# EAGLE design AS1324_imp (EAGLE 6.4)
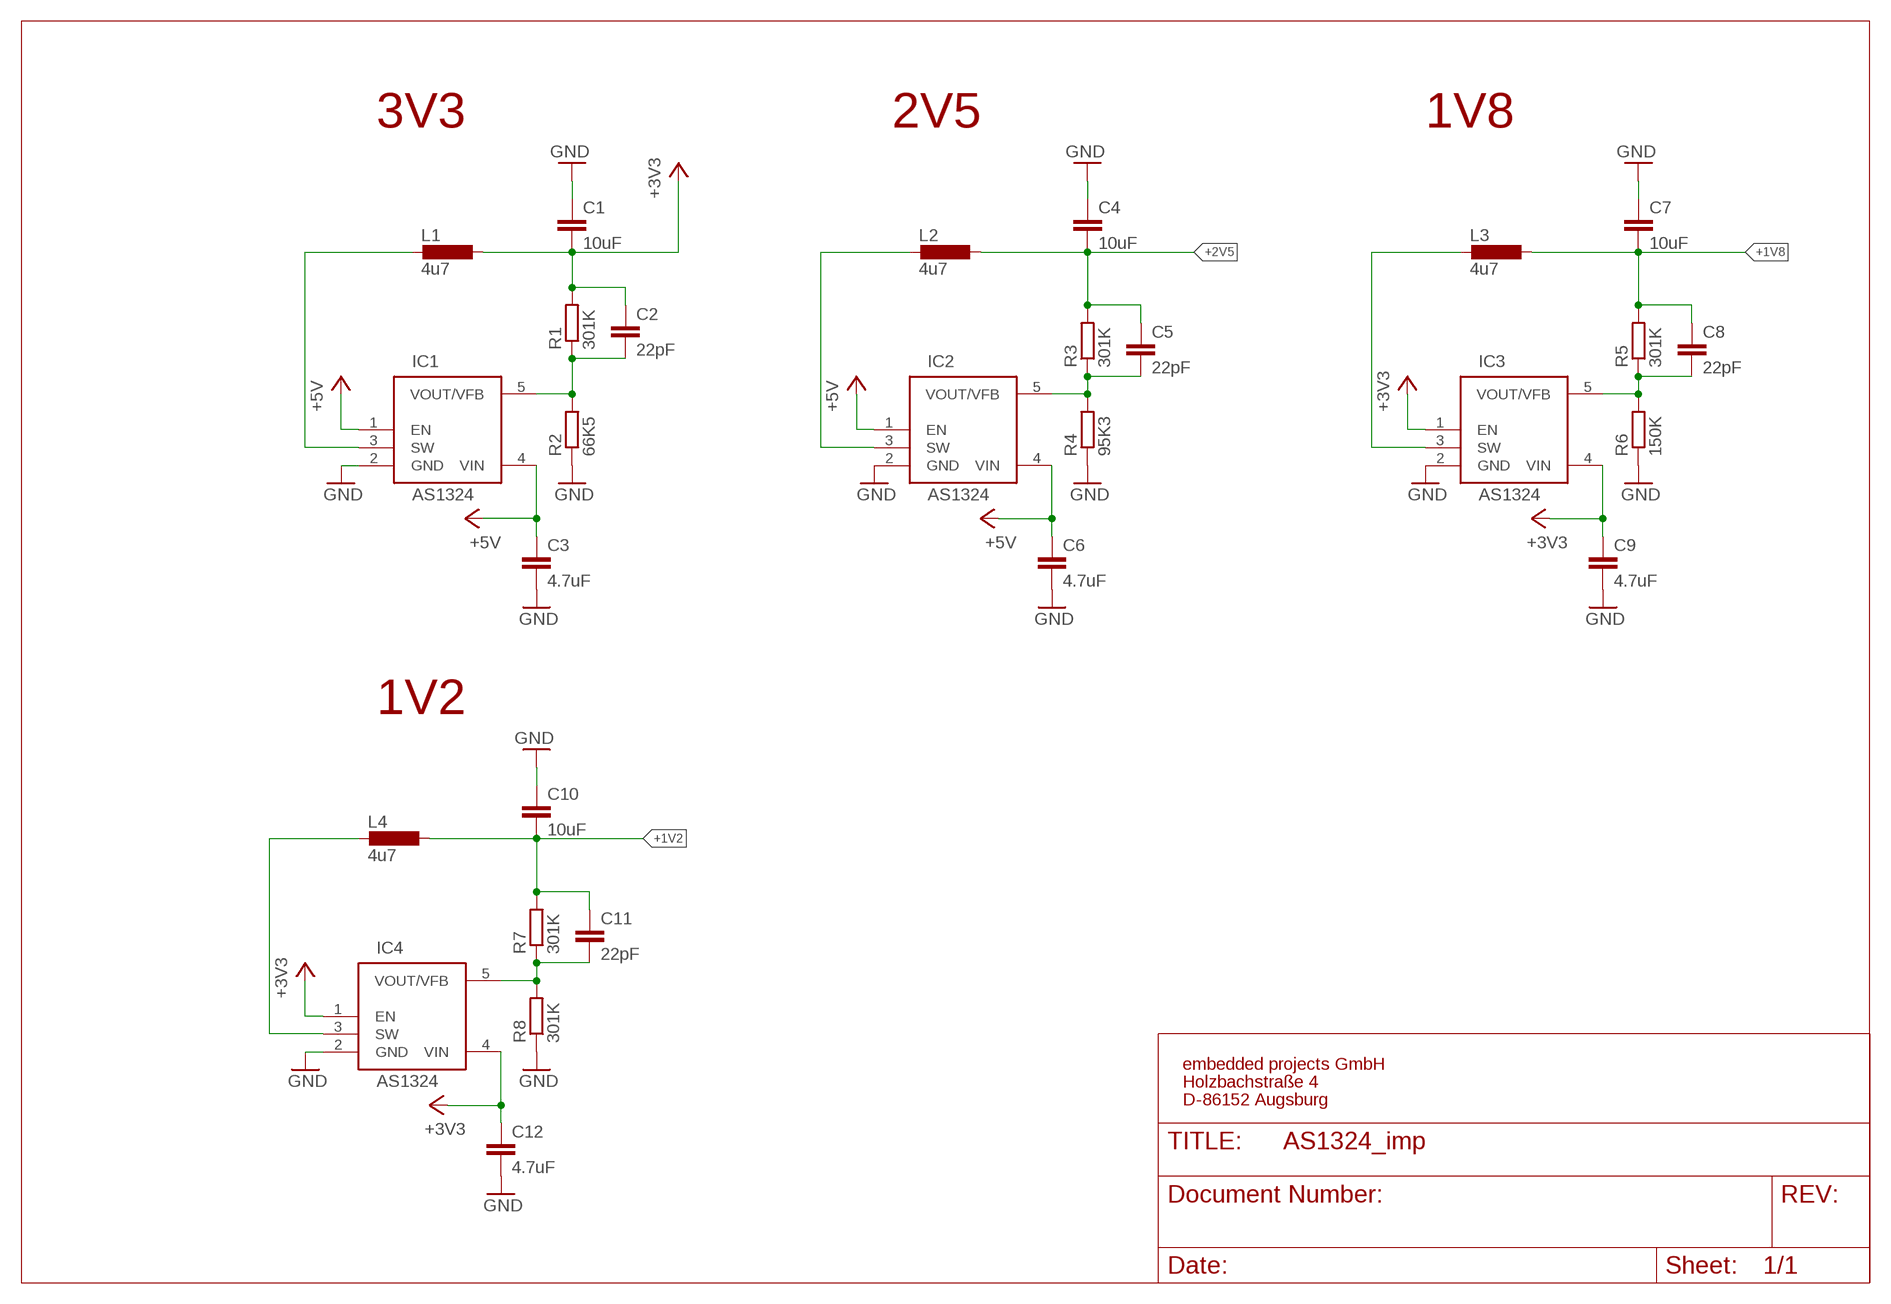
[diagram p0: schematic, sheet 1]

## Parts
C1  10uF  C-EUC0805  [C0805]
C2  22pF  C-EUC0805  [C0805]
C3  4.7uF  C-EUC0805  [C0805]
C4  10uF  C-EUC0805  [C0805]
C5  22pF  C-EUC0805  [C0805]
C6  4.7uF  C-EUC0805  [C0805]
C7  10uF  C-EUC0805  [C0805]
C8  22pF  C-EUC0805  [C0805]
C9  4.7uF  C-EUC0805  [C0805]
C10  10uF  C-EUC0805  [C0805]
C11  22pF  C-EUC0805  [C0805]
C12  4.7uF  C-EUC0805  [C0805]
IC1  AS1324  [TSOT23]
IC2  AS1324  [TSOT23]
IC3  AS1324  [TSOT23]
IC4  AS1324  [TSOT23]
L1  4u7  PSU3014  [PSU3014]
L2  4u7  PSU3014  [PSU3014]
L3  4u7  PSU3014  [PSU3014]
L4  4u7  PSU3014  [PSU3014]
R1  301K  R-EU_R0805  [R0805]
R2  66K5  R-EU_R0805  [R0805]
R3  301K  R-EU_R0805  [R0805]
R4  95K3  R-EU_R0805  [R0805]
R5  301K  R-EU_R0805  [R0805]
R6  150K  R-EU_R0805  [R0805]
R7  301K  R-EU_R0805  [R0805]
R8  301K  R-EU_R0805  [R0805]

## Nets
+1V2: C10.2 C11.1 L4.2 R7.2
+1V8: C7.2 C8.1 L3.2 R5.2
+2V5: C4.2 C5.1 L2.2 R3.2
+3V3: C1.2 C2.1 C9.1 C12.1 IC3.1(EN) IC3.4(VIN) IC4.1(EN) IC4.4(VIN) L1.2 R1.2
+5V: C3.1 C6.1 IC1.1(EN) IC1.4(VIN) IC2.1(EN) IC2.4(VIN)
GND: C1.1 C3.2 C4.1 C6.2 C7.1 C9.2 C10.1 C12.2 IC1.2(GND) IC2.2(GND) IC3.2(GND) IC4.2(GND) R2.1 R4.1 R6.1 R8.1
N$8: IC4.3(SW) L4.1
N$28: IC3.3(SW) L3.1
N$38: C11.2 IC4.5(VOUT/VFB) R7.1 R8.2
N$43: C8.2 IC3.5(VOUT/VFB) R5.1 R6.2
N$67: IC1.3(SW) L1.1
N$132: C2.2 IC1.5(VOUT/VFB) R1.1 R2.2
N$134: IC2.3(SW) L2.1
N$151: C5.2 IC2.5(VOUT/VFB) R3.1 R4.2

## Notes on the sheet
- 3V3 | 2V5 | 1V8
- 1V2
- embedded projects GmbH
- Holzbachstraße 4
- D-86152 Augsburg

## Library data of the parts
C1-C12 = rcl:C-EU: CAPACITOR, European symbol
IC1-IC4 = EmbeddedProjectsBauteile:AS1324: DC/DC Step-Down Regulator; EP: 400124
L1-L4 = KUBUS3B_PARTS2:PSU3014: SMD Power Inductors Shielded
R1-R8 = rcl:R-EU_: RESISTOR, European symbol

## Net classes
0 default: width 0.2 mm, drill 0.3 mm, clearance 0.2 mm
1 500mA: width 0.3 mm, drill 0.3 mm, clearance 0.15 mm
2 5V: width 0.305 mm, drill 0.4 mm, clearance 0.15 mm

## Board
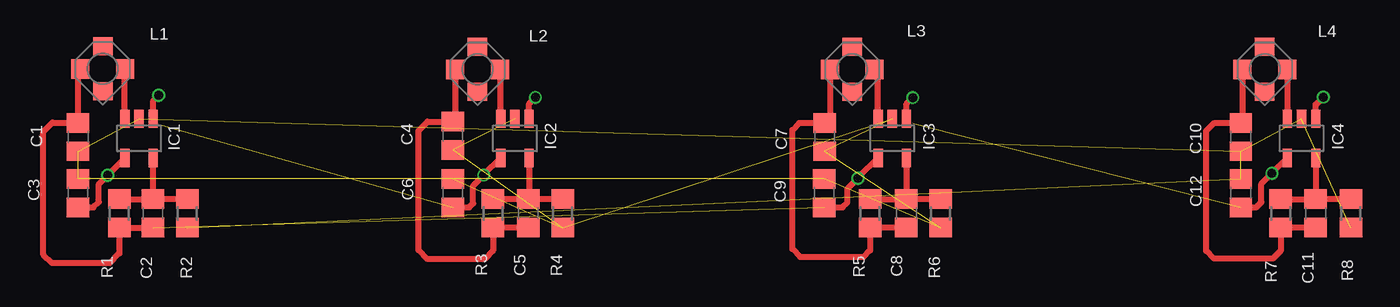
[diagram p1: board, top side]
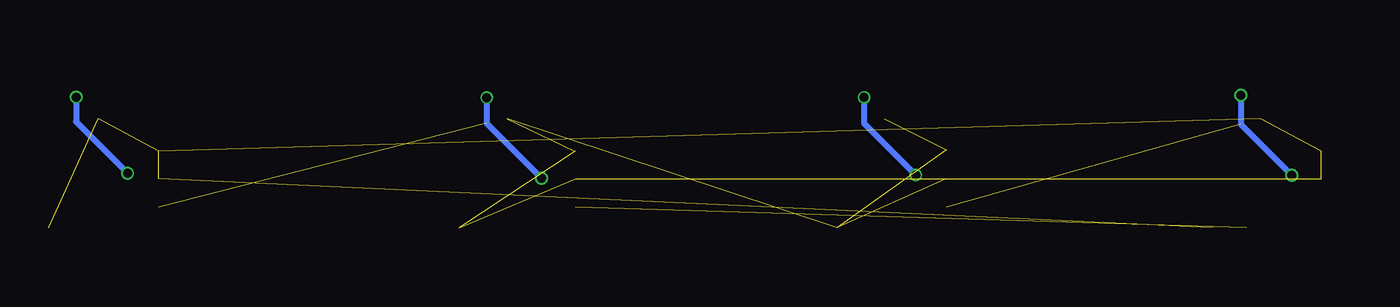
[diagram p2: board, bottom side, seen from below]

No outline drawn. Coordinates in mm, seen from the top.
Copper layers (1*2*15*16): Top 0.012mm / dielectric 0.36mm / Route2 0.018mm / dielectric 0.71mm / Route15 0.035mm / dielectric 0.2mm / Bottom 0.012mm
Design rules "125um_0.2mmborhung_4Layer *": minimum track width 0.125mm, minimum drill 0.25mm, track to track 0.125mm, track to pad 0.125mm, pad to pad 0.125mm, via to via 0.125mm, smd to smd 0mil, copper to edge 0.45mm, drill to drill 0.3mm, minimum pad ring 0.125mm, minimum via ring 0.125mm, stop-mask expansion 0.125mm, vias tented up to drill 40mil, thermal gap 0.2mm
bRestrict: area 51.6,54.2 to 59.1,60

### Footprints (pad centres in the part's own frame; a part is rotated, then mirrored left to right if it is on the bottom)
C0805 = smd 1.3 x 1.5: 1 -0.95,0; 2 0.95,0
TSOT23 = smd 0.622 x 1.22: 1 -0.95,-1.31; 2 0,-1.31; 3 0.95,-1.31; 4 0.95,1.31; 5 -0.95,1.31
PSU3014 = smd 1.2 x 1.3: 1 -1.5,0; 2 1.5,0 | smd 1.3 x 1.2: 3 0,1.5; 4 0,-1.5
R0805 = smd 1.3 x 1.5: 1 -0.95,0; 2 0.95,0

### Placement (x,y rotation side)
C1  11.71,32.23 90 top
C2  16.71,27.13 90 top
C3  11.7,28.48 90 top
C4  36.76,32.32 90 top
C5  41.81,27.13 90 top
C6  36.76,28.48 90 top
C7  61.62,32.23 90 top
C8  67.08,27.13 90 top
C9  61.58,28.48 90 top
C10  89.44,32.23 90 top
C11  94.45,27.13 90 top
C12  89.44,28.48 90 top
IC1  15.78,32.14 180 top
IC2  40.91,32.14 180 top
IC3  66.14,32.14 180 top
IC4  93.5,32.14 180 top
L1  13.36,36.79 180 top
L2  38.41,36.76 180 top
L3  63.46,36.76 180 top
L4  91.04,36.76 180 top
R1  14.47,27.13 270 top
R2  19.01,27.13 90 top
R3  39.44,27.13 270 top
R4  44.1,27.13 90 top
R5  64.66,27.13 270 top
R6  69.36,27.13 90 top
R7  92.1,27.13 270 top
R8  96.8,27.13 90 top

### Tracks (layer width: path | path; a pad name or v marks a point on that pad's centre or on a via)
+1V2
  Top 0.406: L4.2 89.54,33.28 C10.2 87.67,33.18 87.13,32.64 87.13,24.63 87.65,24.11 91.58,24.11 92.1,24.63 R7.2 C11.1
+1V8
  Top 0.406: L3.2 61.96,33.52 C7.2 59.92,33.17 59.45,32.7 59.45,24.75 59.99,24.21 64.21,24.21 64.66,24.66 R5.2 C8.1
+2V5
  Top 0.406: L2.2 36.91,33.42 C4.2 35.07,33.26 34.46,32.65 34.46,24.67 35.05,24.08 38.9,24.08 39.44,24.62 R3.2 C5.1
+3V3  (via drill 0.6)  (2 unrouted)
  Top 0.406: L1.2 11.71,36.64 C1.2 9.99,33.19 9.39,32.59 9.39,24.38 9.97,23.8 13.82,23.8 14.47,24.45 R1.2 C2.1 | IC3.1 67.09,34.45 v67.51,34.87 | IC3.4 63.96,29.6 v63.84,29.47 63.13,28.76 63.13,27.84 62.82,27.53 C9.1 | IC4.1 94.45,34.39 v94.96,34.9 | IC4.4 v91.52,29.8 v91.52,29.81 90.82,29.11 90.82,27.88 90.47,27.53 C12.1
  Bottom 0.406: v67.51,34.87 67.51,33.15 v63.84,29.47 | v94.96,34.9 94.97,33.26 v91.52,29.81
+5V  (via drill 0.6)  (1 unrouted)
  Top 0.406: IC1.1 16.73,34.66 v17.09,35.02 | IC1.4 v13.68,29.68 13.1,29.08 13.1,27.88 12.73,27.53 C3.1 | IC2.1 41.86,34.46 v42.28,34.88 | IC2.4 v38.83,29.7 v38.83,29.69 38.12,28.98 38.12,27.8 37.85,27.53 C6.1
  Bottom 0.406: v17.09,35.02 17.09,33.09 v13.68,29.68 | v42.28,34.88 42.28,33.14 v38.83,29.69
GND  (15 unrouted)
N$8
  Top 0.406: L4.1 IC4.3
N$28
  Top 0.406: IC3.3 65.19,36.53 L3.1
N$38
  Top 0.406: R7.1 C11.2 | R8.2 C11.2 | IC4.5 C11.2
N$43
  Top 0.406: R6.2 C8.2 | R5.1 C8.2 | IC3.5 C8.2
N$67
  Top 0.406: IC1.3 14.83,36.76 L1.1
N$132
  Top 0.406: R1.1 C2.2 | R2.2 C2.2 | C2.2 16.71,30.81 IC1.5
N$134
  Top 0.406: IC2.3 39.96,36.71 L2.1
N$151
  Top 0.406: IC2.5 41.86,28.13 C5.2 | R4.2 C5.2 | C5.2 R3.1

### Text on the board
Document: 5V auf 3,3V | 5V auf 2,5V | 3,3V auf 1,8V | 3,3V auf 1,2V